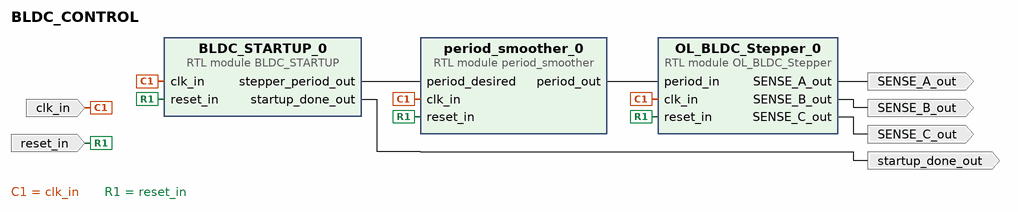
[diagram p0: block diagram of the top level]
# Vivado block design BLDC_CONTROL, xc7z010clg225-1, Vivado 2016.3
create_bd_design BLDC_CONTROL

create_bd_port -dir I clk_in
create_bd_port -dir I -type rst reset_in
create_bd_port -dir O SENSE_A_out
create_bd_port -dir O SENSE_B_out
create_bd_port -dir O SENSE_C_out
create_bd_port -dir O startup_done_out

create_bd_cell -type module -reference BLDC_STARTUP BLDC_STARTUP_0
create_bd_cell -type module -reference period_smoother period_smoother_0
create_bd_cell -type module -reference OL_BLDC_Stepper OL_BLDC_Stepper_0

# ---- connections ----

connect_bd_net [get_bd_ports clk_in] [get_bd_pins BLDC_STARTUP_0/clk_in] [get_bd_pins period_smoother_0/clk_in] [get_bd_pins OL_BLDC_Stepper_0/clk_in]
connect_bd_net [get_bd_ports reset_in] \
  [get_bd_pins BLDC_STARTUP_0/reset_in] [get_bd_pins period_smoother_0/reset_in] [get_bd_pins OL_BLDC_Stepper_0/reset_in]
connect_bd_net [get_bd_pins period_smoother_0/period_out] [get_bd_pins OL_BLDC_Stepper_0/period_in]
connect_bd_net [get_bd_pins BLDC_STARTUP_0/stepper_period_out] [get_bd_pins period_smoother_0/period_desired]
connect_bd_net [get_bd_pins OL_BLDC_Stepper_0/SENSE_A_out] [get_bd_ports SENSE_A_out]
connect_bd_net [get_bd_pins OL_BLDC_Stepper_0/SENSE_B_out] [get_bd_ports SENSE_B_out]
connect_bd_net [get_bd_pins OL_BLDC_Stepper_0/SENSE_C_out] [get_bd_ports SENSE_C_out]
connect_bd_net [get_bd_pins BLDC_STARTUP_0/startup_done_out] [get_bd_ports startup_done_out]

validate_bd_design
save_bd_design
